# Altium schematic sheet A2_shield.SchDoc
size A4; SheetNumber: 2; SheetTotal: 6
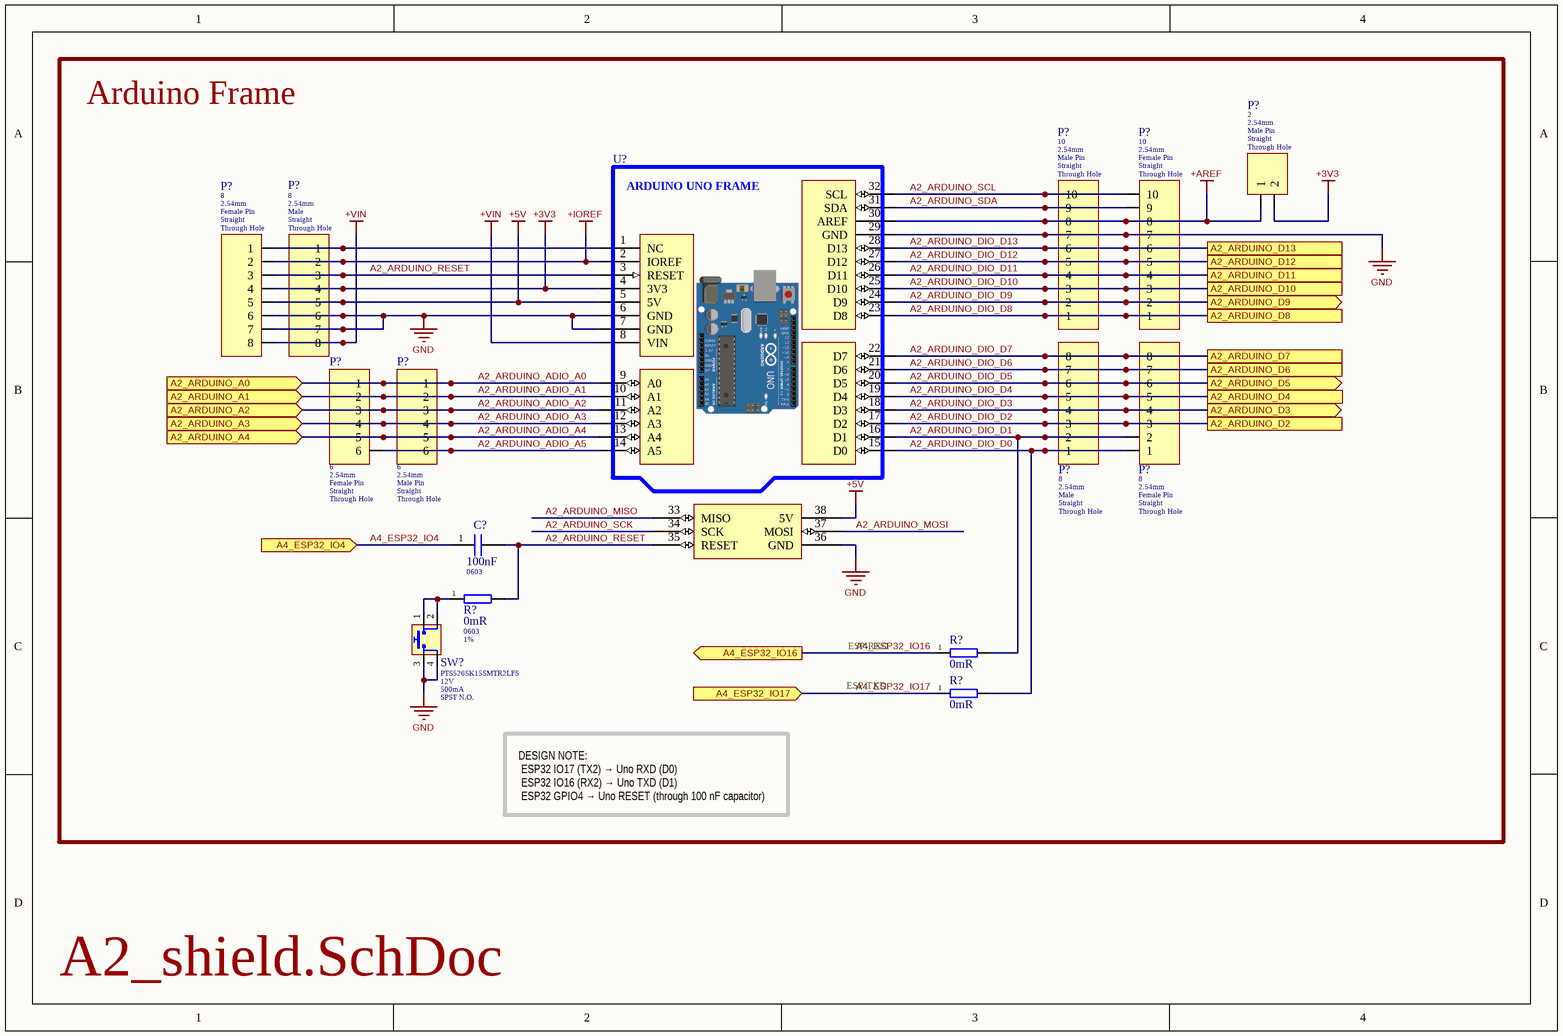
[diagram p0: A2_shield.SchDoc]

## Parts
(Parts that share a designator on the sheet are numbered #1, #2 ... from top to bottom, then left to right.)
C?  Capacitance: 100nF  Case/Package: 0603  [CAPC1608X09N]  (hidden comment: CAP-CER_100n_50V_20%_X7R_0603)
P?#1  Number of Contacts: 2  Pitch: 2.54mm  Contact Type: Male Pin  Orientation: Straight  Mounting Technology: Through Hole  [HARWIN_M20-9730246]  (hidden comment: CON-BS_male_2X1_254_ST_TH)
P?#2  Number of Contacts: 8  Pitch: 2.54mm  Contact Gender: Female Pin  Orientation: Straight  Mounting Technology: Through Hole  [HARWIN_M20-7820842]  (hidden comment: CON-BS_female_8X1_254_ST_TH)
P?#3  Number of Contacts: 8  Pitch: 2.54mm  Contact Gender: Male  Orientation: Straight  Mounting Technology: Through Hole  [HARWIN_M20-9730845]  (hidden comment: CON-BS_male_8X1_254_ST_TH)
P?#4  Number of Contacts: 10  Pitch: 2.54mm  Connector Type: Male Pin  Orientation: Straight  Mounting Technology: Through Hole  [HARWIN_M20-9731045]  (hidden comment: CON-BS_male_10X1_254_ST_TH)
P?#5  Number of Contacts: 10  Pitch: 2.54mm  Contact Gender: Female Pin  Orientation: Straight  Mounting Technology: Through Hole  [HARWIN_M20-7821046]  (hidden comment: CON-BS_female_10X1_254_ST_TH)
P?#6  Number of Contacts: 6  Pitch: 2.54mm  Contact Gender: Female Pin  Orientation: Straight  Mounting Technology: Through Hole  [HARWIN_M20-7820646]  (hidden comment: CON-BS_female_6X1_254_ST_TH)
P?#7  Number of Contacts: 6  Pitch: 2.54mm  Connector Type: Male Pin  Orientation: Straight  Mounting Technology: Through Hole  [HARWIN_M20-9730645]  (hidden comment: CON-BS_male_6X1_254_ST_TH)
P?#8  Number of Contacts: 8  Pitch: 2.54mm  Contact Gender: Male  Orientation: Straight  Mounting Technology: Through Hole  [HARWIN_M20-9730845]  (hidden comment: CON-BS_male_8X1_254_ST_TH)
P?#9  Number of Contacts: 8  Pitch: 2.54mm  Contact Gender: Female Pin  Orientation: Straight  Mounting Technology: Through Hole  [HARWIN_M20-7820842]  (hidden comment: CON-BS_female_8X1_254_ST_TH)
R?#1  Resistance: 0mR  Case/Package: 0603  Tolerance: 1%  [RESC1608X06N]  (hidden comment: RES_0R_100mW_1%_0603)
R?#2  Resistance: 0mR  [RESC1608X06N]  (hidden comment: RES_0R_100mW_1%_0603)
R?#3  Resistance: 0mR  [RESC1608X06N]  (hidden comment: RES_0R_100mW_1%_0603)
SW?  MFG PN: PTS526SK15SMTR2LFS  _Maximum Voltage: 12V  _Maximum Current: 500mA  _Function: SPST N.O.  [CK_PTS526SK15SMTR2LFS]  (hidden comment: SW_Tactile_1_SPST-N.O._12_500m_SMD)
U?  ARDUINO_UNO-FRAME-01  [ARDUINO_UNO_FRAME]  (value not drawn)  (no BOM)

## Ports
A2_ARDUINO_A0 (in), A2_ARDUINO_A1 (in), A2_ARDUINO_A2 (in), A2_ARDUINO_A3 (in), A2_ARDUINO_A4 (in), A2_ARDUINO_D2, A2_ARDUINO_D3 (out), A2_ARDUINO_D4, A2_ARDUINO_D5 (out), A2_ARDUINO_D6, A2_ARDUINO_D7, A2_ARDUINO_D8, A2_ARDUINO_D9 (out), A2_ARDUINO_D10, A2_ARDUINO_D11, A2_ARDUINO_D12, A2_ARDUINO_D13, A4_ESP32_IO4 (in), A4_ESP32_IO16 (out), A4_ESP32_IO17 (in)

## Nets
+3V3: P?#1.2 P?#2.4 P?#3.4 U?.4(3V3)
+5V: P?#2.5 P?#3.5 U?.5(5V) U?.38(5V)
+AREF: P?#1.1 P?#4.8 P?#5.8 U?.30(AREF)
+IOREF: P?#2.2 P?#3.2 U?.2(IOREF)
+VIN: P?#2.8 P?#3.8 U?.8(VIN)
GND: P?#2.6 P?#2.7 P?#3.6 P?#3.7 P?#4.7 P?#5.7 SW?.3 SW?.4 U?.6(GND) U?.7(GND) U?.29(GND) U?.36(GND)
A2_ARDUINO_ADIO_A0: P?#6.1 P?#7.1 U?.9(A0) ; port A2_ARDUINO_A0
A2_ARDUINO_ADIO_A1: P?#6.2 P?#7.2 U?.10(A1) ; port A2_ARDUINO_A1
A2_ARDUINO_ADIO_A2: P?#6.3 P?#7.3 U?.11(A2) ; port A2_ARDUINO_A2
A2_ARDUINO_ADIO_A3: P?#6.4 P?#7.4 U?.12(A3) ; port A2_ARDUINO_A3
A2_ARDUINO_ADIO_A4: P?#6.5 P?#7.5 U?.13(A4) ; port A2_ARDUINO_A4
A2_ARDUINO_ADIO_A5: P?#6.6 P?#7.6 U?.14(A5)
A2_ARDUINO_DIO_D0: P?#8.1 P?#9.1 R?#3.2 U?.15(D0)
A2_ARDUINO_DIO_D1: P?#8.2 P?#9.2 R?#2.2 U?.16(D1)
A2_ARDUINO_DIO_D2: P?#8.3 P?#9.3 U?.17(D2) ; port A2_ARDUINO_D2
A2_ARDUINO_DIO_D3: P?#8.4 P?#9.4 U?.18(D3) ; port A2_ARDUINO_D3
A2_ARDUINO_DIO_D4: P?#8.5 P?#9.5 U?.19(D4) ; port A2_ARDUINO_D4
A2_ARDUINO_DIO_D5: P?#8.6 P?#9.6 U?.20(D5) ; port A2_ARDUINO_D5
A2_ARDUINO_DIO_D6: P?#8.7 P?#9.7 U?.21(D6) ; port A2_ARDUINO_D6
A2_ARDUINO_DIO_D7: P?#8.8 P?#9.8 U?.22(D7) ; port A2_ARDUINO_D7
A2_ARDUINO_DIO_D8: P?#4.1 P?#5.1 U?.23(D8) ; port A2_ARDUINO_D8
A2_ARDUINO_DIO_D9: P?#4.2 P?#5.2 U?.24(D9) ; port A2_ARDUINO_D9
A2_ARDUINO_DIO_D10: P?#4.3 P?#5.3 U?.25(D10) ; port A2_ARDUINO_D10
A2_ARDUINO_DIO_D11: P?#4.4 P?#5.4 U?.26(D11) ; port A2_ARDUINO_D11
A2_ARDUINO_DIO_D12: P?#4.5 P?#5.5 U?.27(D12) ; port A2_ARDUINO_D12
A2_ARDUINO_DIO_D13: P?#4.6 P?#5.6 U?.28(D13) ; port A2_ARDUINO_D13
A2_ARDUINO_MISO: U?.33(MISO)
A2_ARDUINO_MOSI: U?.37(MOSI)
A2_ARDUINO_RESET: C?.2 P?#2.3 P?#3.3 R?#1.2 U?.3(RESET) U?.35(RESET)
A2_ARDUINO_SCK: U?.34(SCK)
A2_ARDUINO_SCL: P?#4.10 P?#5.10 U?.32(SCL)
A2_ARDUINO_SDA: P?#4.9 P?#5.9 U?.31(SDA)
A4_ESP32_IO4: C?.1 ; port A4_ESP32_IO4
A4_ESP32_IO16: R?#2.1 ; port A4_ESP32_IO16
A4_ESP32_IO17: R?#3.1 ; port A4_ESP32_IO17
NetP?#2_1: P?#2.1 P?#3.1 U?.1(NC)
NetR?#1_1: R?#1.1 SW?.1 SW?.2

## Notes on the sheet
- Arduino Frame
- ESP-RXD
- ESP-TXD
- DESIGN NOTE:
  ESP32 IO17 (TX2) → Uno RXD (D0)
  ESP32 IO16 (RX2) → Uno TXD (D1)
  ESP32 GPIO4 → Uno RESET (through 100 nF capacitor)
- (in symbol Arduino_Uno-Frame-01) ARDUINO UNO FRAME

## Library data of the parts
C? = Kemet_C0603C104M5RAC: MFG: KEMET; Dielectric Material: Ceramic; Tolerance: 20%; _Checked_PCB: HoP; Dielectric: X7R; Voltage Rating (DC): 50V; Supplier 1: Mouser; MFG PN: C0603C104M5RAC; RoHS: Yes; Category: Ceramic Capacitors; Stock 1: 461921; Pricing 1: 1=0.1, 10=0.033, 50=0.033, 100=0.015, 1000=0.009, 10000=0.006 (USD); Mount: Surface Mount; Case Code (Imperial): 0603; Case Code (Metric): 1608; Min Operating Temperature: -55°C; Max Operating Temperature: 125°C; Packaging: Tape and Reel; Package Quantity: 4000; Termination: SMD/SMT; Series: C0603C; Construction: Flat; Length: 1.6mm; Width: 0.8mm; RoHS Compliant: Yes; ComponentLink1URL: http://www.mouser.com/ds/2/212/KEM_C1002_X7R_SMD-1102033.pdf?src-supplier=Mouser; ComponentLink1Description: http://www.mouser.com/ds/2/212/KEM_C1002_X7R_SMD-1102033.pdf?src-supplier=Mouser; Supplier Part Number 1: 80-C0603C104M5RAC; _Checked_SCH: HoP; _Creator: HoP; _SYM_REF: CAP-CER_100n_50V_20%_X7R_0603
P?#1 = Harwin_M20-9730246: MFG: Harwin; Current Rating: 3A; Voltage Rating: 750V; Contact Resistance: 30mR; Mated Stacking Heights: 16.54mm; _Checked_PCB: N.A; _Checked_SCH: HoP; Supplier: Mouser; Supplier Part Number: 855-M20-9730246; MFG PN: M20-9730246; RoHS: Yes; Category: Headers and Wire Housings; Stock: 7153; Pricing: 1=0.1, 10=0.08, 50=0.08, 100=0.066, 1000=0.053, 10000=0.043 (USD); Case/Package: SIL; Contact Material: Brass; Contact Plating: Tin; Color: Black; Housing Color: Black; Housing Material: Nylon; Contact Shape: Square; Contact Finish - Mating: TIN; Insulation Material: Nylon; Insulation Color: Black; Min Operating Temperature: -40°C; Max Operating Temperature: 105°C; Number of Rows: 1; Max Current Rating: 3A; Number of Positions: 2; Termination: Solder; Package Quantity: 1000; Packaging: Bulk; Series: M20; Fastening Type: Pull; Length: 5.08mm; Depth: 2.54mm; Contact Mating Length: 0.276inch; Radiation Hardening: No; RoHS Compliant: Yes; Flammability Rating: UL94 V-0; ComponentLink1URL: https://datasheet.ciiva.com/26899/getdatasheetpartid-501522-26899400.pdf?src-supplier=Verical; ComponentLink1Description: https://datasheet.ciiva.com/26899/getdatasheetpartid-501522-26899400.pdf?src-supplier=Verical; _Creator: HoP; _SYM_REF: CON-BS_male_2X1_254_ST_TH
P?#2 P?#9 = Harwin_M20-7820842: MFG: Harwin; Connector Type: Receptacle, Socket; Contact Resistance: 20mΩ; Current Rating: 3A; Dielectric Material: Polyamide; Gender: Female; Insulation Resistance: 1GΩ; _Checked_PCB: N.A; _Creator: HoP; Supplier: DigiKey; Supplier Part Number: 952-1823-ND; MFG PN: M20-7820842; RoHS: Compliant; Category: Card Edge Connectors; Stock: 504; Pricing: 1=1.27, 27=1.0063, 108=0.91231, 513=0.81725, 1026=0.77824, 5022=0.69577, 10017=0.66272 (USD); Case/Package: SIL; Color: Black; Contact Material: Bronze; Depth: 2.5mm; Housing Color: Black; Housing Material: Polyamide; Length: 20.72mm; Lifecycle Status: Production; Max Current Rating: 3A; Max Operating Temperature: 105°C; Min Operating Temperature: -40°C; Pins: 8; Number of Positions: 8; Number of Rows: 1; Radiation Hardening: No; REACH SVHC: Yes; Terminal Pitch: 2.54mm; Termination: Solder; Weight: 719.992839mg; ComponentLink1URL: https://datasheet.octopart.com:443/M20-7820842-Harwin-datasheet-176383844.pdf?src-supplier=Newark; ComponentLink1Description: https://datasheet.octopart.com:443/M20-7820842-Harwin-datasheet-176383844.pdf?src-supplier=Newark; ComponentLink2URL: https://datasheet.octopart.com:443/M20-7820842-Harwin-datasheet-99119574.pdf?src-supplier=Master+Electronics; ComponentLink2Description: https://datasheet.octopart.com:443/M20-7820842-Harwin-datasheet-99119574.pdf?src-supplier=Master+Electronics; ComponentLink3URL: http://sigma.octopart.com:80/15888290/rohs_statement/Harwin-M20-7820842.pdf?src-supplier=Compliance+Statements; ComponentLink3Description: http://sigma.octopart.com:80/15888290/rohs_statement/Harwin-M20-7820842.pdf?src-supplier=Compliance+Statements; _Checked_SCH: N.A; _SYM_REF: CON-BS_female_8X1_254_ST_TH; Contact Plating: Gold, Tin
P?#3 P?#8 = Harwin_M20-9730845: MFG: Harwin; Connector Type: Male Pin; Contact Resistance: 25mΩ; Current Rating: 3A; Dielectric Material: Polyamide; Insulation Resistance: 1GΩ; Voltage Rating: 750V; _Checked_PCB: N.A; _Checked_SCH: HoP; Supplier: DigiKey; Supplier Part Number: 952-1999-ND; MFG PN: M20-9730845; RoHS: Compliant; Category: Card Edge Connectors; Stock: 3821; Pricing: 1=0.43, 10=0.365, 100=0.3103, 500=0.2769, 1000=0.26367, 5000=0.23535, 10000=0.22412 (USD); Case/Package: SIL; Color: Black; Contact Material: Brass; Contact Mating Length: 7.0104mm; Contact Plating: Gold; Depth: 2.54mm; Gender: Male; Housing Color: Black; Housing Material: Nylon; Length: 20.32mm; Lifecycle Status: Production; Max Current Rating: 3A; Max Operating Temperature: 105°C; Min Operating Temperature: -40°C; Pins: 8; Number of Positions: 8; Number of Rows: 1; Radiation Hardening: No; REACH SVHC: Yes; Terminal Pitch: 2.54mm; Termination: Solder; ComponentLink1URL: https://datasheet.octopart.com:443/M20-9730845-Harwin-datasheet-179990786.pdf?src-supplier=IHS; ComponentLink1Description: https://datasheet.octopart.com:443/M20-9730845-Harwin-datasheet-179990786.pdf?src-supplier=IHS; _Creator: HoP; _SYM_REF: CON-BS_male_8X1_254_ST_TH
P?#4 = Harwin_M20-9731045: MFG: Harwin; Contact Resistance: 25mΩ; Current Rating: 3A; Dielectric Material: Polyamide; Gender: Male; Insulation Resistance: 1GΩ; Voltage Rating: 750V; _Checked_PCB: N.A; _Checked_SCH: HoP; Supplier: DigiKey; Supplier Part Number: 952-1841-ND; MFG PN: M20-9731045; RoHS: Compliant; Category: Card Edge Connectors; Stock: 614; Pricing: 1=0.54, 10=0.455, 100=0.387, 500=0.34534, 1000=0.32885, 5000=0.29354, 10000=0.27953 (USD); Case/Package: SIL; Color: Black; Contact Gender: Male; Contact Material: Brass; Contact Mating Length: 7.0104mm; Contact Plating: Gold; Depth: 2.54mm; Housing Color: Black; Housing Material: Nylon; Length: 25.4mm; Lifecycle Status: Production; Max Current Rating: 3A; Max Operating Temperature: 105°C; Min Operating Temperature: -40°C; Pins: 10; Number of Positions: 10; Number of Rows: 1; Radiation Hardening: No; REACH SVHC: Yes; Terminal Pitch: 2.54mm; Termination: Solder; ComponentLink1URL: https://datasheet.octopart.com:443/M20-9731045-Harwin-datasheet-179990786.pdf?src-supplier=IHS; ComponentLink1Description: https://datasheet.octopart.com:443/M20-9731045-Harwin-datasheet-179990786.pdf?src-supplier=IHS; _Creator: HoP; _SYM_REF: CON-BS_male_10X1_254_ST_TH
P?#5 = Harwin_M20-7821046: MFG: Harwin; Connector Type: Receptacle, Socket; Contact Resistance: 20mΩ; Current Rating: 3A; Dielectric Material: Polyamide; Gender: Female; Hole Diameter: 800µm; Insulation Resistance: 1GΩ; Operating Force: 4.8928N; _Checked_PCB: N.A; _Checked_SCH: HoP; Supplier: DigiKey; Supplier Part Number: 952-1847-ND; MFG PN: M20-7821046; RoHS: Compliant; Category: Card Edge Connectors; Stock: 1359; Pricing: 1=1.37, 22=1.10409, 110=0.98555, 506=0.88482, 1012=0.84258, 5016=0.75263, 10010=0.71686 (USD); Case/Package: SIL; Color: Black; Contact Material: Bronze; Contact Plating: Tin; Depth: 2.5mm; Housing Color: Black; Housing Material: Polyamide; Lead Pitch: 2.54mm; Length: 25.8mm; Lifecycle Status: Production; Max Current Rating: 3A; Max Operating Temperature: 105°C; Min Operating Temperature: -40°C; Pins: 10; Number of Positions: 10; Number of Rows: 1; Radiation Hardening: No; REACH SVHC: Yes; Terminal Pitch: 2.54mm; Termination: Solder; ComponentLink1URL: https://datasheet.octopart.com:443/M20-7821046-Harwin-datasheet-176383844.pdf?src-supplier=Electro+Sonic; ComponentLink1Description: https://datasheet.octopart.com:443/M20-7821046-Harwin-datasheet-176383844.pdf?src-supplier=Electro+Sonic; ComponentLink2URL: https://datasheet.octopart.com:443/M20-7821046-Harwin-datasheet-99119574.pdf?src-supplier=Upverter; ComponentLink2Description: https://datasheet.octopart.com:443/M20-7821046-Harwin-datasheet-99119574.pdf?src-supplier=Upverter; ComponentLink3URL: https://datasheet.octopart.com:443/M20-7821046-Harwin-datasheet-526273.pdf?src-supplier=Upverter; ComponentLink3Description: https://datasheet.octopart.com:443/M20-7821046-Harwin-datasheet-526273.pdf?src-supplier=Upverter; ComponentLink4URL: https://datasheet.octopart.com:443/M20-7821046-Harwin-datasheet-96624206.pdf?src-supplier=element14+APAC; ComponentLink4Description: https://datasheet.octopart.com:443/M20-7821046-Harwin-datasheet-96624206.pdf?src-supplier=element14+APAC; ComponentLink5URL: https://datasheet.octopart.com:443/M20-7821046-Harwin-datasheet-6396485.pdf?src-supplier=Newark; ComponentLink5Description: https://datasheet.octopart.com:443/M20-7821046-Harwin-datasheet-6396485.pdf?src-supplier=Newark; ComponentLink6URL: https://datasheet.octopart.com:443/M20-7821046-Harwin-datasheet-32864534.pdf?src-supplier=Newark; ComponentLink6Description: https://datasheet.octopart.com:443/M20-7821046-Harwin-datasheet-32864534.pdf?src-supplier=Newark; ComponentLink7URL: https://datasheet.octopart.com:443/M20-7821046-Harwin-datasheet-15888280.pdf?src-supplier=Newark; ComponentLink7Description: https://datasheet.octopart.com:443/M20-7821046-Harwin-datasheet-15888280.pdf?src-supplier=Newark; ComponentLink8URL: https://datasheet.octopart.com:443/M20-7821046-Harwin-datasheet-188872139.pdf?src-supplier=TME; ComponentLink8Description: https://datasheet.octopart.com:443/M20-7821046-Harwin-datasheet-188872139.pdf?src-supplier=TME; ComponentLink9URL: https://datasheet.octopart.com:443/M20-7821046-Harwin-datasheet-14706651.pdf?src-supplier=Farnell; ComponentLink9Description: https://datasheet.octopart.com:443/M20-7821046-Harwin-datasheet-14706651.pdf?src-supplier=Farnell; ComponentLink10URL: http://sigma.octopart.com:80/15888295/rohs_statement/Harwin-M20-7821046.pdf?src-supplier=Compliance+Statements; ComponentLink10Description: http://sigma.octopart.com:80/15888295/rohs_statement/Harwin-M20-7821046.pdf?src-supplier=Compliance+Statements; _Creator: HoP; _SYM_REF: CON-BS_female_10X1_254_ST_TH
P?#6 = Harwin_M20-7820646: MFG: Harwin; Connector Type: Receptacle, Socket; Contact Resistance: 20mΩ; Current Rating: 3A; Dielectric Material: Polyamide; Gender: Female; Insulation Resistance: 1GΩ; _Checked_PCB: N.A; _Checked_SCH: HoP; Supplier: DigiKey; Supplier Part Number: 952-1809-ND; MFG PN: M20-7820646; RoHS: Compliant; Category: Card Edge Connectors; Stock: 1442; Pricing: 1=1.11, 36=0.86417, 108=0.79954, 504=0.7171, 1008=0.68287, 5004=0.60989, 10008=0.58081 (USD); Case/Package: SIL; Color: Black; Contact Material: Bronze; Contact Plating: Tin; Depth: 2.5mm; Housing Color: Black; Housing Material: Nylon; Length: 15.64mm; Lifecycle Status: Production; Max Current Rating: 3A; Max Operating Temperature: 105°C; Min Operating Temperature: -40°C; Pins: 6; Number of Positions: 6; Number of Rows: 1; Radiation Hardening: No; REACH SVHC: Yes; Terminal Pitch: 2.54mm; Termination: Solder; ComponentLink1URL: https://datasheet.octopart.com:443/M20-7820646-Harwin-datasheet-176383844.pdf?src-supplier=Newark; ComponentLink1Description: https://datasheet.octopart.com:443/M20-7820646-Harwin-datasheet-176383844.pdf?src-supplier=Newark; ComponentLink2URL: https://datasheet.octopart.com:443/M20-7820646-Harwin-datasheet-99119574.pdf?src-supplier=Farnell; ComponentLink2Description: https://datasheet.octopart.com:443/M20-7820646-Harwin-datasheet-99119574.pdf?src-supplier=Farnell; ComponentLink3URL: https://datasheet.octopart.com:443/M20-7820646-Harwin-datasheet-188872139.pdf?src-supplier=TME; ComponentLink3Description: https://datasheet.octopart.com:443/M20-7820646-Harwin-datasheet-188872139.pdf?src-supplier=TME; ComponentLink4URL: https://datasheet.octopart.com:443/M20-7820646-Harwin-datasheet-137074310.pdf?src-supplier=X-ON; ComponentLink4Description: https://datasheet.octopart.com:443/M20-7820646-Harwin-datasheet-137074310.pdf?src-supplier=X-ON; ComponentLink5URL: http://sigma.octopart.com:80/15888285/rohs_statement/Harwin-M20-7820646.pdf?src-supplier=Compliance+Statements; ComponentLink5Description: http://sigma.octopart.com:80/15888285/rohs_statement/Harwin-M20-7820646.pdf?src-supplier=Compliance+Statements; _Creator: HoP; _SYM_REF: CON-BS_female_6X1_254_ST_TH
P?#7 = Harwin_M20-9730645: MFG: Harwin; Contact Resistance: 25mΩ; Current Rating: 3A; Dielectric Material: Polyamide; Insulation Resistance: 1GΩ; Voltage Rating: 750V; _Checked_PCB: N.A; _Checked_SCH: HoP; Supplier: DigiKey; Supplier Part Number: 952-1984-ND; MFG PN: M20-9730645; RoHS: Compliant; Category: Headers and Wire Housings; Stock: 2418; Pricing: 1=0.33, 10=0.282, 100=0.2395, 500=0.21372, 1000=0.20351, 5000=0.18165, 10000=0.17298 (USD); Case/Package: SIL; Color: Black; Contact Gender: Male; Contact Material: Brass; Contact Mating Length: 7.0104mm; Contact Plating: Gold; Depth: 2.54mm; Housing Color: Black; Housing Material: Nylon; Length: 15.24mm; Lifecycle Status: Production; Max Current Rating: 3A; Max Operating Temperature: 105°C; Min Operating Temperature: -40°C; Pins: 6; Number of Positions: 6; Number of Rows: 1; Packaging: Bulk; Radiation Hardening: No; REACH SVHC: Yes; Terminal Pitch: 2.54mm; Termination: Solder; ComponentLink1URL: https://datasheet.octopart.com:443/M20-9730645-Harwin-datasheet-179990786.pdf?src-supplier=IHS; ComponentLink1Description: https://datasheet.octopart.com:443/M20-9730645-Harwin-datasheet-179990786.pdf?src-supplier=IHS; _Creator: HoP; _SYM_REF: CON-BS_male_6X1_254_ST_TH
R?#1 = Yageo_RC0603FR-070RL: MFG: Yageo; Power Rating: 100mW; Voltage Rating (DC): 50V; Temperature Coefficient: 200ppm/°C; _Checked_PCB: HoP; _Value: 0; Supplier 1: Mouser; MFG PN: RC0603FR-070RL; RoHS: Yes; Category: Chip SMD Resistors; Stock 1: 3348927; Pricing 1: 1=0.1, 10=0.01, 50=0.01, 100=0.005, 1000=0.004, 10000=0.003 (USD); Number of Pins: 2; Contact Plating: Tin,Matte; Case Code (Metric): 1608; Case Code (Imperial): 0603; Min Operating Temperature: -55°C; Max Operating Temperature: 155°C; Packaging: Tape and Reel; Resistor Type: Thick Film; Package Quantity: 5000; Voltage Rating: 50V; Number of Terminations: 2; Termination: SMD/SMT; Max Power Dissipation: 100mW; Features: Moisture Resistant; Series: RC; Construction: Rectangular; Resistance Tolerance: 1%; Technology: THICK FILM; Length: 1.6mm; Width: 0.8mm; Height: 0.45mm; Depth: 0.8mm; Reach SVHC Compliant: No; Lead Free: Lead Free; RoHS Compliant: Yes; Military Standard: Not; ComponentLink1URL: https://datasheet.ciiva.com/11808/0900766b80f96399-11808172.pdf?src-supplier=Rs; ComponentLink1Description: https://datasheet.ciiva.com/11808/0900766b80f96399-11808172.pdf?src-supplier=Rs; ComponentLink2URL: https://datasheet.ciiva.com/5684/443971-5684699.pdf?src-supplier=Farnell; ComponentLink2Description: https://datasheet.ciiva.com/5684/443971-5684699.pdf?src-supplier=Farnell; ComponentLink3URL: https://datasheet.ciiva.com/7983/443971-7983627.pdf?src-supplier=Element14; ComponentLink3Description: https://datasheet.ciiva.com/7983/443971-7983627.pdf?src-supplier=Element14; ComponentLink4URL: https://datasheet.ciiva.com/22643/1868787-22643388.pdf?src-supplier=Element14; ComponentLink4Description: https://datasheet.ciiva.com/22643/1868787-22643388.pdf?src-supplier=Element14; ComponentLink5URL: https://datasheet.ciiva.com/46382/443971-46382072.pdf?src-supplier=Element14; ComponentLink5Description: https://datasheet.ciiva.com/46382/443971-46382072.pdf?src-supplier=Element14; ComponentLink6URL: https://datasheet.ciiva.com/29721/pyu-r-int-thick-7-29721178.pdf?src-supplier=Digi-Key; ComponentLink6Description: https://datasheet.ciiva.com/29721/pyu-r-int-thick-7-29721178.pdf?src-supplier=Digi-Key; ComponentLink7URL: https://datasheet.ciiva.com/29721/pyu-rc0603-51-rohs-l-4-29721179.pdf?src-supplier=Digi-Key; ComponentLink7Description: https://datasheet.ciiva.com/29721/pyu-rc0603-51-rohs-l-4-29721179.pdf?src-supplier=Digi-Key; ComponentLink8URL: https://datasheet.ciiva.com/5558/rc0603-272842-5558341.pdf?src-supplier=Mouser; ComponentLink8Description: https://datasheet.ciiva.com/5558/rc0603-272842-5558341.pdf?src-supplier=Mouser; Supplier Part Number 1: 603-RC0603FR-070RL; _Checked_SCH: HoP; _Creator: HoP; _SYM_REF: RES_0R_100mW_1%_0603
R?#2 R?#3 = Yageo_RC0603FR-070RL: MFG: Yageo; Power Rating: 100mW; Voltage Rating (DC): 50V; Temperature Coefficient: 200ppm/°C; Resistance Tolerance: 1%; _Checked_PCB: HoP; _Value: 0; Supplier 1: Mouser; MFG PN: RC0603FR-070RL; RoHS: Yes; Category: Chip SMD Resistors; Stock 1: 3348927; Pricing 1: 1=0.1, 10=0.01, 50=0.01, 100=0.005, 1000=0.004, 10000=0.003 (USD); Number of Pins: 2; Contact Plating: Tin,Matte; Case Code (Metric): 1608; Case Code (Imperial): 0603; Min Operating Temperature: -55°C; Max Operating Temperature: 155°C; Packaging: Tape and Reel; Resistor Type: Thick Film; Package Quantity: 5000; Voltage Rating: 50V; Number of Terminations: 2; Termination: SMD/SMT; Max Power Dissipation: 100mW; Features: Moisture Resistant; Series: RC; Construction: Rectangular; Technology: THICK FILM; Length: 1.6mm; Width: 0.8mm; Height: 0.45mm; Depth: 0.8mm; Reach SVHC Compliant: No; Lead Free: Lead Free; RoHS Compliant: Yes; Military Standard: Not; ComponentLink1URL: https://datasheet.ciiva.com/11808/0900766b80f96399-11808172.pdf?src-supplier=Rs; ComponentLink1Description: https://datasheet.ciiva.com/11808/0900766b80f96399-11808172.pdf?src-supplier=Rs; ComponentLink2URL: https://datasheet.ciiva.com/5684/443971-5684699.pdf?src-supplier=Farnell; ComponentLink2Description: https://datasheet.ciiva.com/5684/443971-5684699.pdf?src-supplier=Farnell; ComponentLink3URL: https://datasheet.ciiva.com/7983/443971-7983627.pdf?src-supplier=Element14; ComponentLink3Description: https://datasheet.ciiva.com/7983/443971-7983627.pdf?src-supplier=Element14; ComponentLink4URL: https://datasheet.ciiva.com/22643/1868787-22643388.pdf?src-supplier=Element14; ComponentLink4Description: https://datasheet.ciiva.com/22643/1868787-22643388.pdf?src-supplier=Element14; ComponentLink5URL: https://datasheet.ciiva.com/46382/443971-46382072.pdf?src-supplier=Element14; ComponentLink5Description: https://datasheet.ciiva.com/46382/443971-46382072.pdf?src-supplier=Element14; ComponentLink6URL: https://datasheet.ciiva.com/29721/pyu-r-int-thick-7-29721178.pdf?src-supplier=Digi-Key; ComponentLink6Description: https://datasheet.ciiva.com/29721/pyu-r-int-thick-7-29721178.pdf?src-supplier=Digi-Key; ComponentLink7URL: https://datasheet.ciiva.com/29721/pyu-rc0603-51-rohs-l-4-29721179.pdf?src-supplier=Digi-Key; ComponentLink7Description: https://datasheet.ciiva.com/29721/pyu-rc0603-51-rohs-l-4-29721179.pdf?src-supplier=Digi-Key; ComponentLink8URL: https://datasheet.ciiva.com/5558/rc0603-272842-5558341.pdf?src-supplier=Mouser; ComponentLink8Description: https://datasheet.ciiva.com/5558/rc0603-272842-5558341.pdf?src-supplier=Mouser; Supplier Part Number 1: 603-RC0603FR-070RL; _Checked_SCH: HoP; _Creator: HoP; _SYM_REF: RES_0R_100mW_1%_0603; Case/Package: 0603; Tolerance: 1%
SW? = CK_PTS526SK15SMTR2LFS: MFG: ITT C&K; _Checked_PCB: HoP; Supplier 1: Mouser; RoHS: No; Category: Uncategorized; Stock 1: 68360; Pricing 1: 1=0.13, 10=0.128, 50=0.128, 100=0.11, 1000=0.079, 10000=0.067 (USD); Supplier Part Number 1: 611-PTS526SK15SMR2L; _Checked_SCH: HoP; _Creator: HoP; _SYM_REF: SW_Tactile_1_SPST-N.O._12_500m_SMD
U? = Arduino_Uno-Frame-01: _Creator: HoP; _Checked_SCH: HoP; _Checked_PCB: *; _SYM_REF: ARDUINO_UNO-FRAME-01; MFG: *; MFG PN: *; Value: *